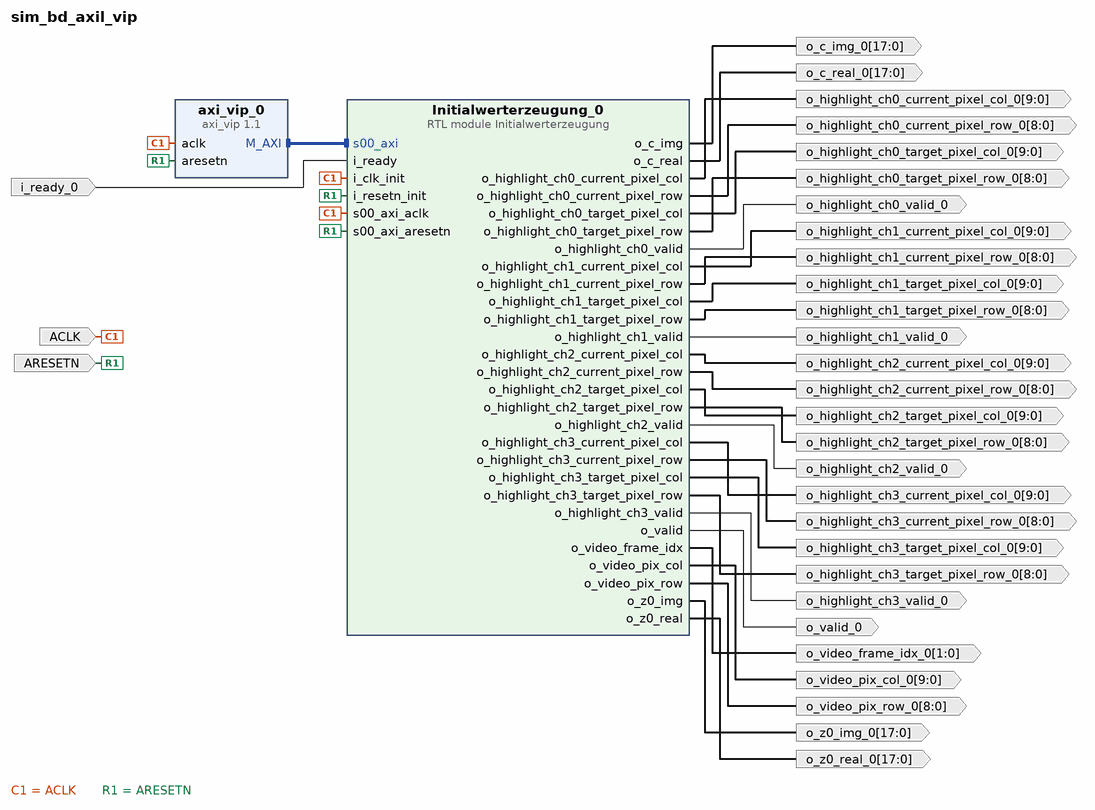
[diagram p0: block diagram of the top level]
# Vivado block design sim_bd_axil_vip, xc7a100tcsg324-1, Vivado 2023.2
create_bd_design sim_bd_axil_vip

create_bd_port -dir I -type clk ACLK
set_property -dict {CONFIG.ASSOCIATED_RESET ARESETN} [get_bd_ports ACLK]
create_bd_port -dir I -type rst ARESETN
set_property -dict {CONFIG.POLARITY ACTIVE_LOW} [get_bd_ports ARESETN]
create_bd_port -dir I i_ready_0
create_bd_port -dir O o_valid_0
create_bd_port -dir O -from 9 -to 0 o_video_pix_col_0
create_bd_port -dir O -from 8 -to 0 o_video_pix_row_0
create_bd_port -dir O -from 1 -to 0 o_video_frame_idx_0
create_bd_port -dir O -from 17 -to 0 o_z0_real_0
create_bd_port -dir O -from 17 -to 0 o_z0_img_0
create_bd_port -dir O -from 17 -to 0 o_c_real_0
create_bd_port -dir O -from 17 -to 0 o_c_img_0
create_bd_port -dir O o_highlight_ch0_valid_0
create_bd_port -dir O -from 9 -to 0 o_highlight_ch0_current_pixel_col_0
create_bd_port -dir O -from 8 -to 0 o_highlight_ch0_current_pixel_row_0
create_bd_port -dir O -from 9 -to 0 o_highlight_ch0_target_pixel_col_0
create_bd_port -dir O -from 8 -to 0 o_highlight_ch0_target_pixel_row_0
create_bd_port -dir O o_highlight_ch1_valid_0
create_bd_port -dir O -from 9 -to 0 o_highlight_ch1_current_pixel_col_0
create_bd_port -dir O -from 8 -to 0 o_highlight_ch1_current_pixel_row_0
create_bd_port -dir O -from 9 -to 0 o_highlight_ch1_target_pixel_col_0
create_bd_port -dir O -from 8 -to 0 o_highlight_ch1_target_pixel_row_0
create_bd_port -dir O o_highlight_ch2_valid_0
create_bd_port -dir O -from 9 -to 0 o_highlight_ch2_current_pixel_col_0
create_bd_port -dir O -from 8 -to 0 o_highlight_ch2_current_pixel_row_0
create_bd_port -dir O -from 9 -to 0 o_highlight_ch2_target_pixel_col_0
create_bd_port -dir O -from 8 -to 0 o_highlight_ch2_target_pixel_row_0
create_bd_port -dir O o_highlight_ch3_valid_0
create_bd_port -dir O -from 9 -to 0 o_highlight_ch3_current_pixel_col_0
create_bd_port -dir O -from 8 -to 0 o_highlight_ch3_current_pixel_row_0
create_bd_port -dir O -from 9 -to 0 o_highlight_ch3_target_pixel_col_0
create_bd_port -dir O -from 8 -to 0 o_highlight_ch3_target_pixel_row_0

create_bd_cell -type ip -vlnv xilinx.com:ip:axi_vip:1.1 axi_vip_0
set_property -dict [list \
  CONFIG.ADDR_WIDTH 32 \
  CONFIG.DATA_WIDTH 32 \
  CONFIG.HAS_BRESP 1 \
  CONFIG.HAS_PROT 1 \
  CONFIG.HAS_RRESP 1 \
  CONFIG.HAS_WSTRB 1 \
  CONFIG.INTERFACE_MODE MASTER \
  CONFIG.PROTOCOL AXI4LITE \
  CONFIG.READ_WRITE_MODE READ_WRITE \
] [get_bd_cells axi_vip_0]
create_bd_cell -type module -reference Initialwerterzeugung Initialwerterzeugung_0

# ---- connections ----

connect_bd_intf_net [get_bd_intf_pins axi_vip_0/M_AXI] [get_bd_intf_pins Initialwerterzeugung_0/s00_axi]
connect_bd_net [get_bd_pins Initialwerterzeugung_0/o_c_img] [get_bd_ports o_c_img_0]
connect_bd_net [get_bd_pins Initialwerterzeugung_0/o_c_real] [get_bd_ports o_c_real_0]
connect_bd_net [get_bd_pins Initialwerterzeugung_0/o_highlight_ch0_current_pixel_col] [get_bd_ports o_highlight_ch0_current_pixel_col_0]
connect_bd_net [get_bd_pins Initialwerterzeugung_0/o_highlight_ch0_current_pixel_row] [get_bd_ports o_highlight_ch0_current_pixel_row_0]
connect_bd_net [get_bd_pins Initialwerterzeugung_0/o_highlight_ch0_target_pixel_col] [get_bd_ports o_highlight_ch0_target_pixel_col_0]
connect_bd_net [get_bd_pins Initialwerterzeugung_0/o_highlight_ch0_target_pixel_row] [get_bd_ports o_highlight_ch0_target_pixel_row_0]
connect_bd_net [get_bd_pins Initialwerterzeugung_0/o_highlight_ch0_valid] [get_bd_ports o_highlight_ch0_valid_0]
connect_bd_net [get_bd_pins Initialwerterzeugung_0/o_highlight_ch1_current_pixel_col] [get_bd_ports o_highlight_ch1_current_pixel_col_0]
connect_bd_net [get_bd_pins Initialwerterzeugung_0/o_highlight_ch1_current_pixel_row] [get_bd_ports o_highlight_ch1_current_pixel_row_0]
connect_bd_net [get_bd_pins Initialwerterzeugung_0/o_highlight_ch1_target_pixel_col] [get_bd_ports o_highlight_ch1_target_pixel_col_0]
connect_bd_net [get_bd_pins Initialwerterzeugung_0/o_highlight_ch1_target_pixel_row] [get_bd_ports o_highlight_ch1_target_pixel_row_0]
connect_bd_net [get_bd_pins Initialwerterzeugung_0/o_highlight_ch1_valid] [get_bd_ports o_highlight_ch1_valid_0]
connect_bd_net [get_bd_pins Initialwerterzeugung_0/o_highlight_ch2_current_pixel_col] [get_bd_ports o_highlight_ch2_current_pixel_col_0]
connect_bd_net [get_bd_pins Initialwerterzeugung_0/o_highlight_ch2_current_pixel_row] [get_bd_ports o_highlight_ch2_current_pixel_row_0]
connect_bd_net [get_bd_pins Initialwerterzeugung_0/o_highlight_ch2_target_pixel_col] [get_bd_ports o_highlight_ch2_target_pixel_col_0]
connect_bd_net [get_bd_pins Initialwerterzeugung_0/o_highlight_ch2_target_pixel_row] [get_bd_ports o_highlight_ch2_target_pixel_row_0]
connect_bd_net [get_bd_pins Initialwerterzeugung_0/o_highlight_ch2_valid] [get_bd_ports o_highlight_ch2_valid_0]
connect_bd_net [get_bd_pins Initialwerterzeugung_0/o_highlight_ch3_current_pixel_col] [get_bd_ports o_highlight_ch3_current_pixel_col_0]
connect_bd_net [get_bd_pins Initialwerterzeugung_0/o_highlight_ch3_current_pixel_row] [get_bd_ports o_highlight_ch3_current_pixel_row_0]
connect_bd_net [get_bd_pins Initialwerterzeugung_0/o_highlight_ch3_target_pixel_col] [get_bd_ports o_highlight_ch3_target_pixel_col_0]
connect_bd_net [get_bd_pins Initialwerterzeugung_0/o_highlight_ch3_target_pixel_row] [get_bd_ports o_highlight_ch3_target_pixel_row_0]
connect_bd_net [get_bd_pins Initialwerterzeugung_0/o_highlight_ch3_valid] [get_bd_ports o_highlight_ch3_valid_0]
connect_bd_net [get_bd_pins Initialwerterzeugung_0/o_valid] [get_bd_ports o_valid_0]
connect_bd_net [get_bd_pins Initialwerterzeugung_0/o_video_frame_idx] [get_bd_ports o_video_frame_idx_0]
connect_bd_net [get_bd_pins Initialwerterzeugung_0/o_video_pix_col] [get_bd_ports o_video_pix_col_0]
connect_bd_net [get_bd_pins Initialwerterzeugung_0/o_video_pix_row] [get_bd_ports o_video_pix_row_0]
connect_bd_net [get_bd_pins Initialwerterzeugung_0/o_z0_img] [get_bd_ports o_z0_img_0]
connect_bd_net [get_bd_pins Initialwerterzeugung_0/o_z0_real] [get_bd_ports o_z0_real_0]
connect_bd_net -net aclk_0_1 [get_bd_ports ACLK] \
  [get_bd_pins axi_vip_0/aclk] [get_bd_pins Initialwerterzeugung_0/i_clk_init] \
  [get_bd_pins Initialwerterzeugung_0/s00_axi_aclk]
connect_bd_net -net aresetn_0_1 [get_bd_ports ARESETN] \
  [get_bd_pins axi_vip_0/aresetn] [get_bd_pins Initialwerterzeugung_0/i_resetn_init] \
  [get_bd_pins Initialwerterzeugung_0/s00_axi_aresetn]
connect_bd_net -net i_ready_0_1 [get_bd_ports i_ready_0] [get_bd_pins Initialwerterzeugung_0/i_ready]

# ---- address map ----
assign_bd_address -offset 0x00000000 -range 4K -target_address_space [get_bd_addr_spaces axi_vip_0/Master_AXI] [get_bd_addr_segs Initialwerterzeugung_0/s00_axi/reg0]

validate_bd_design
save_bd_design
